# EAGLE design SCD30_pcb (EAGLE 9.5.2)
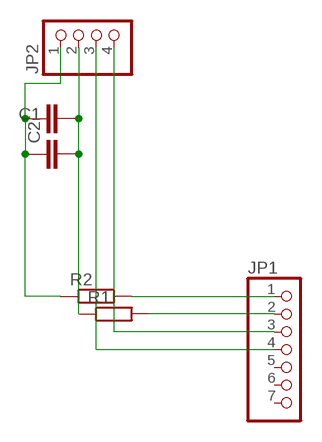
[diagram p0: schematic, sheet 1]

## Parts
C1  C2,5-3  [C2.5-3]
C2  C5/2.5  [C5B2.5]
JP1  PINHD-1X7  [1X07]
JP2  PINHD-1X4/90  [1X04/90]
R1  R-EU_0204/7  [0204/7]
R2  R-EU_0204/7  [0204/7]

## Nets
N$1: JP1.3 JP2.4
N$2: JP1.4 JP2.3
N$3: JP1.2 R1.2
N$4: JP1.1 R2.2
N$5: C1.2 C2.2 JP2.2 R1.1
N$6: C1.1 C2.1 JP2.1 R2.1
Unconnected: JP1.5 JP1.6 JP1.7

## Library data of the parts
C1 C2 = capacitor-wima:C: CAPACITOR naming: grid - package width
JP1 = pinhead:PINHD-1X7: PIN HEADER
JP2 = pinhead:PINHD-1X4: PIN HEADER
R1 R2 = rcl:R-EU_: RESISTOR, European symbol; SPICEPREFIX: R

## Board
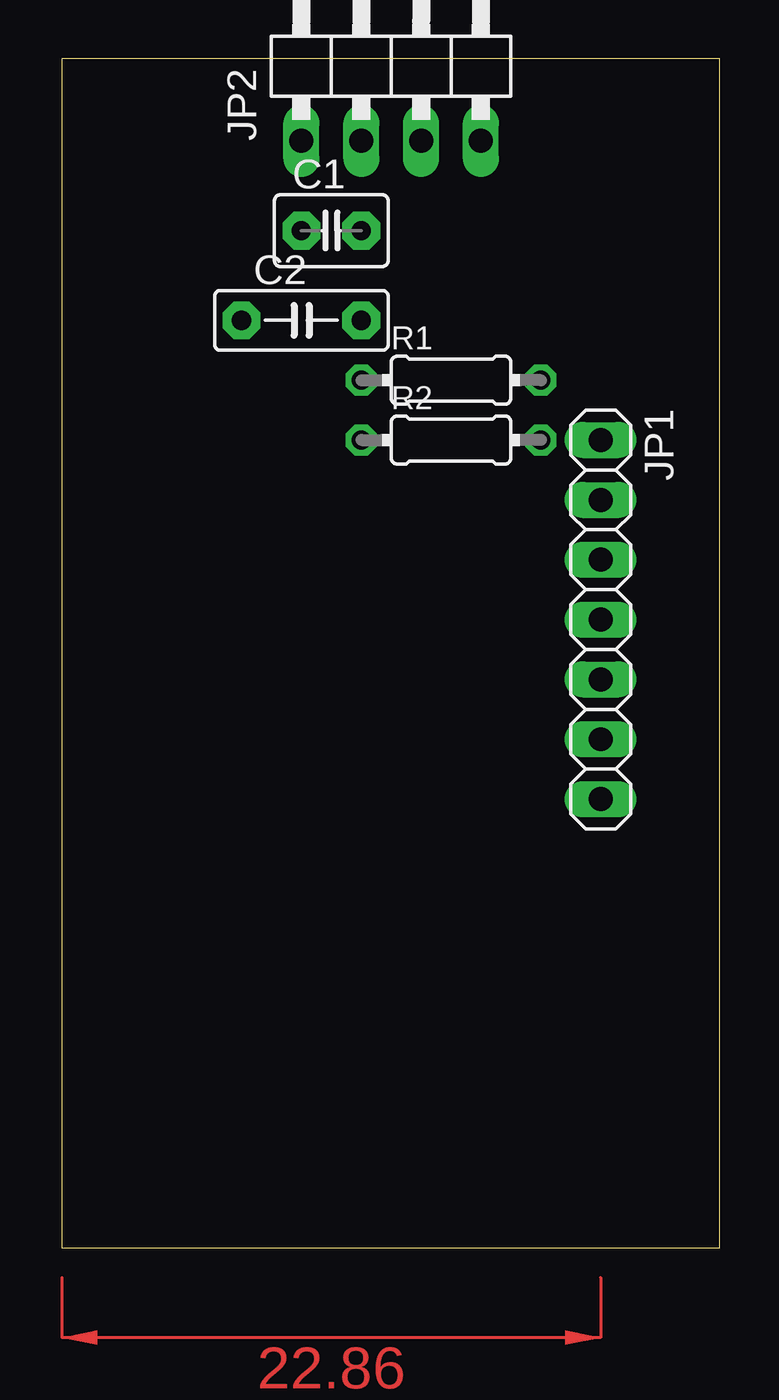
[diagram p1: board, top side]
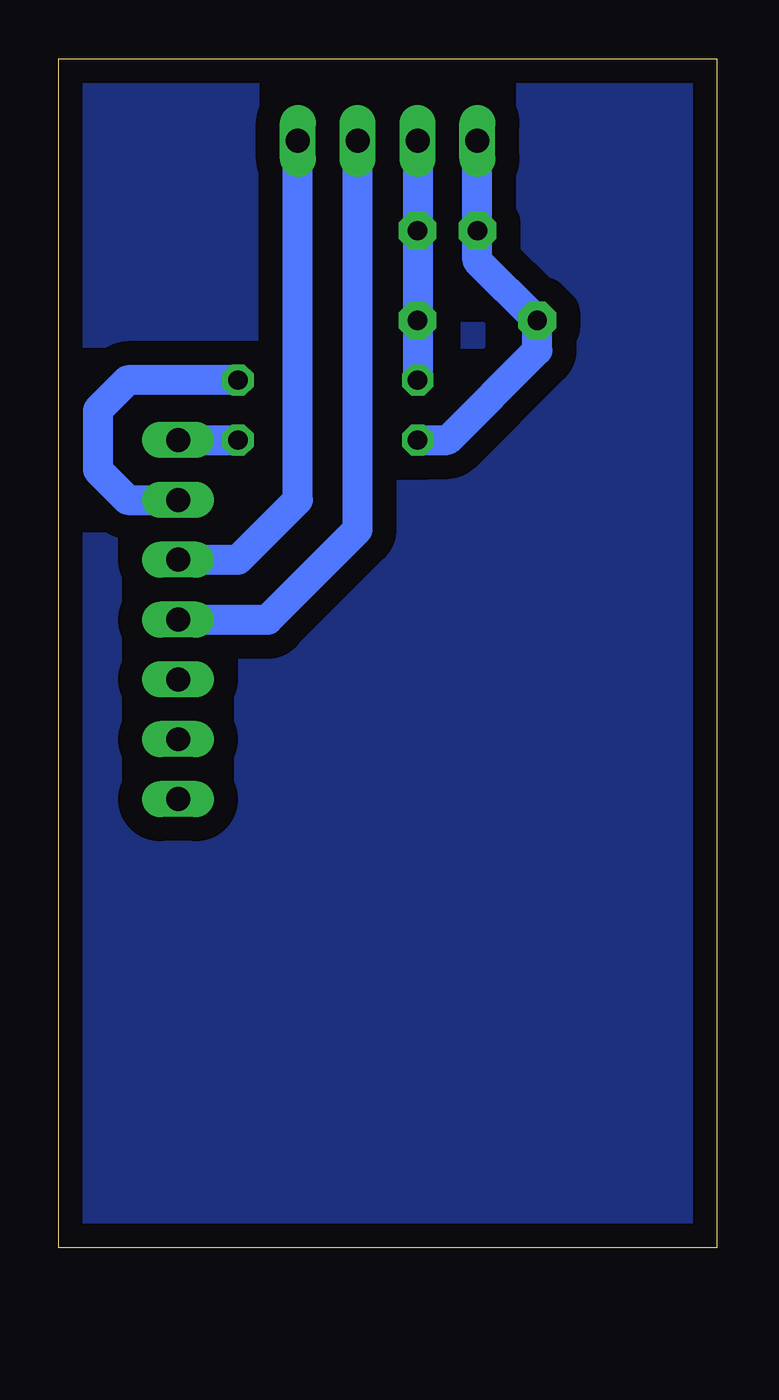
[diagram p2: board, bottom side, seen from below]

Size 27.92 x 50.47 mm. Coordinates in mm from the lower left corner, seen from the top.
Outline: 0,0 27.92,0 27.92,50.47 0,50.47 0,0
Copper layers (1*16): Top 0.035mm / dielectric 1.5mm / Bottom 0.035mm
Design rules "default *": minimum track width 6mil, minimum drill 0.35mm, track to track 6mil, track to pad 6mil, pad to pad 6mil, via to via 6mil, smd to smd 6mil, copper to edge 40mil, drill to drill 6mil, minimum pad ring 10mil, minimum via ring 8mil, stop-mask expansion 4mil, vias tented up to drill 0mil, thermal gap 10mil

### Footprints (pad centres in the part's own frame; a part is rotated, then mirrored left to right if it is on the bottom)
C2.5-3 = drill 0.813 pad 1.6 octagon: 1 -1.27,0; 2 1.27,0
C5B2.5 = drill 0.813 pad 1.6 octagon: 1 -2.54,0; 2 2.54,0
1X07 = drill 1.016 long: 1 -7.62,0; 2 -5.08,0; 3 -2.54,0; 4 0,0; 5 2.54,0; 6 5.08,0; 7 7.62,0
1X04/90 = drill 1.016 long: 1 -3.81,-3.81; 2 -1.27,-3.81; 3 1.27,-3.81; 4 3.81,-3.81
0204/7 = drill 0.813 octagon: 1 -3.81,0; 2 3.81,0

### Placement (x,y rotation side)
C1  11.43,43.18 0 top
C2  10.16,39.37 0 top
JP1  22.86,26.67 270 top
JP2  13.97,50.8 0 top
R1  16.51,36.83 0 top
R2  16.51,34.29 0 top

### Tracks (layer width: path | path; a pad name or v marks a point on that pad's centre or on a via)
N$1
  Bottom 1.27: JP1.3 20.32,29.21 17.78,31.75 JP2.4
N$2
  Bottom 1.27: JP1.4 19.05,26.67 15.24,30.48 JP2.3
N$3
  Bottom 1.27: R1.2 25,36.83 26.27,35.56 26.27,33.02 25,31.75 JP1.2
N$4
  Bottom 1.27: JP1.1 R2.2
N$5
  Bottom 1.27: JP2.2 C1.2 C2.2 R1.1
N$6
  Bottom 1.27: R2.1 11.43,34.29 7.62,38.1 C2.1 10.16,41.91 C1.1 JP2.1
N$7
  pour Bottom (isolate 1.016): 0,50.8 0,0 27.94,0 27.94,50.8
(copper drawn outside any net)
  shapes: Top area x3